# EAGLE schematic mcp23017 (EAGLE 6.0)
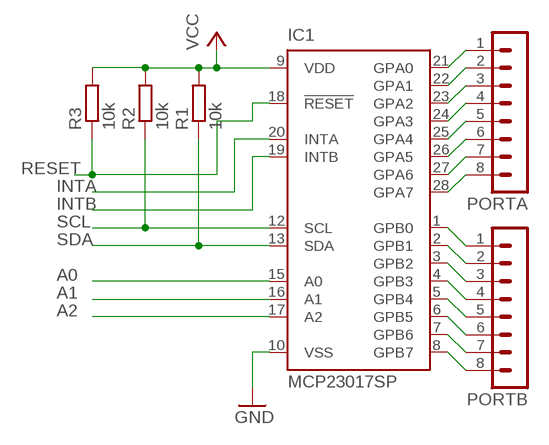
[diagram p0: schematic, sheet 1]

## Parts
IC1  MCP23017SP  [DIL28-3]
PORTA  MA08-1  [MA08-1]
PORTB  MA08-1  [MA08-1]
R1  10k  R-EU_0207/7  [0207/7]
R2  10k  R-EU_0207/7  [0207/7]
R3  10k  R-EU_0207/7  [0207/7]

## Nets
A0: IC1.15(A0)
A1: IC1.16(A1)
A2: IC1.17(A2)
GND: IC1.10(VSS)
INTA: IC1.20(INTA)
INTB: IC1.19(INTB)
N$1: IC1.1(GPB0) PORTB.1
N$2: IC1.2(GPB1) PORTB.2
N$3: IC1.3(GPB2) PORTB.3
N$4: IC1.4(GPB3) PORTB.4
N$5: IC1.5(GPB4) PORTB.5
N$6: IC1.6(GPB5) PORTB.6
N$7: IC1.7(GPB6) PORTB.7
N$8: IC1.8(GPB7) PORTB.8
N$9: IC1.21(GPA0) PORTA.1
N$10: IC1.22(GPA1) PORTA.2
N$11: IC1.23(GPA2) PORTA.3
N$12: IC1.24(GPA3) PORTA.4
N$13: IC1.25(GPA4) PORTA.5
N$14: IC1.26(GPA5) PORTA.6
N$15: IC1.27(GPA6) PORTA.7
N$16: IC1.28(GPA7) PORTA.8
RESET: IC1.18(!RESET) R3.1
SCL: IC1.12(SCL) R2.1
SDA: IC1.13(SDA) R1.1
VCC: IC1.9(VDD) R1.2 R2.2 R3.2

## Library data of the parts
IC1 = microchip:MCP23017: http://ww1.microchip.com/downloads/en/DeviceDoc/21952a.pdf Source: http://ww1.microchip.com/downloads/en/DeviceDoc/21952a.pdf; MF: MICROCHIP; MPN: MCP23017-E/SP; OC_FARNELL: 1332088; OC_NEWARK: 31K2959
PORTA PORTB = con-lstb:MA08-1: PIN HEADER; OC_FARNELL: unknown; OC_NEWARK: unknown
R1-R3 = rcl:R-EU_: RESISTOR, European symbol